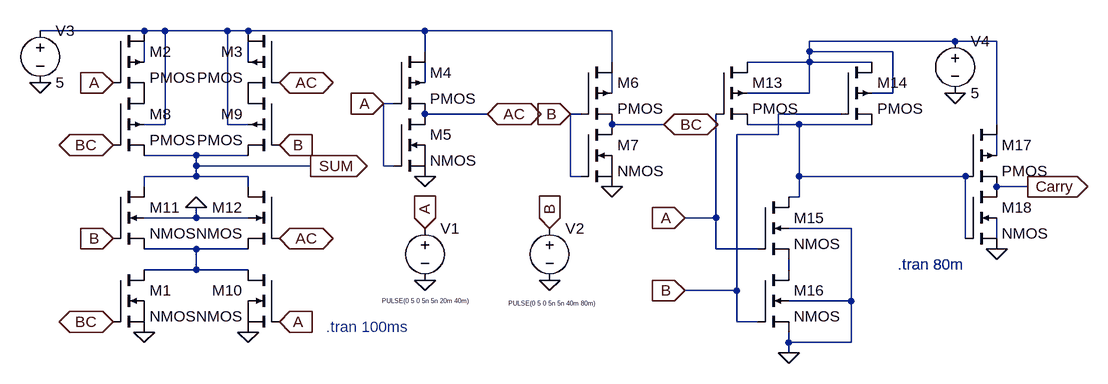
[diagram p0: schematic Half Adder sum and carry.asc]
Half Adder sum and carry.asc, the LTspice schematic file:
Version 4.1
SHEET 1 1616 680
WIRE -544 -256 -704 -256
WIRE -512 -256 -544 -256
WIRE -416 -256 -512 -256
WIRE -384 -256 -416 -256
WIRE -112 -256 -384 -256
WIRE 176 -256 -112 -256
WIRE 704 -240 480 -240
WIRE 768 -240 704 -240
WIRE -112 -224 -112 -256
WIRE 480 -224 480 -240
WIRE 608 -224 480 -224
WIRE -544 -208 -544 -240
WIRE -384 -208 -384 -240
WIRE 176 -208 176 -256
WIRE 480 -208 480 -224
WIRE 480 -208 384 -208
WIRE 576 -208 480 -208
WIRE -112 -176 -112 -208
WIRE 176 -160 176 -192
WIRE 480 -160 480 -208
WIRE 480 -160 384 -160
WIRE 608 -160 608 -224
WIRE 608 -160 576 -160
WIRE -160 -144 -176 -144
WIRE -16 -128 -112 -128
WIRE 128 -128 112 -128
WIRE 528 -128 432 -128
WIRE -512 -112 -512 -256
WIRE -512 -112 -544 -112
WIRE -416 -112 -416 -256
WIRE -384 -112 -416 -112
WIRE 256 -112 176 -112
WIRE 464 -112 384 -112
WIRE 576 -112 464 -112
WIRE 768 -112 768 -240
WIRE 432 -96 432 -128
WIRE 432 -96 368 -96
WIRE -464 -64 -544 -64
WIRE -384 -64 -464 -64
WIRE 768 -64 768 -96
WIRE -464 -48 -464 -64
WIRE -288 -48 -464 -48
WIRE -176 -48 -176 -144
WIRE -160 -48 -176 -48
WIRE -464 -32 -464 -48
WIRE -464 -32 -544 -32
WIRE -384 -32 -464 -32
WIRE 112 -32 112 -128
WIRE 128 -32 112 -32
WIRE 464 -32 464 -112
WIRE 720 -32 464 -32
WIRE -544 -16 -544 -32
WIRE -384 -16 -384 -32
WIRE 816 -16 768 -16
WIRE 464 0 464 -32
WIRE 464 0 448 0
WIRE -464 32 -464 16
WIRE -464 32 -544 32
WIRE -384 32 -464 32
WIRE 336 32 336 -128
WIRE 336 32 288 32
WIRE 544 48 448 48
WIRE 720 64 720 -32
WIRE 768 64 768 32
WIRE -464 80 -544 80
WIRE -384 80 -464 80
WIRE 336 80 336 32
WIRE 400 80 336 80
WIRE -464 112 -464 80
WIRE -464 112 -544 112
WIRE -384 112 -464 112
WIRE 448 112 448 96
WIRE 368 144 368 -96
WIRE 368 144 288 144
WIRE 544 160 544 48
WIRE 544 160 448 160
WIRE 368 192 368 144
WIRE 400 192 368 192
WIRE 448 224 448 208
WIRE 544 224 544 160
WIRE 544 224 448 224
WIRE 448 240 448 224
FLAG 80 128 0
FLAG -112 128 0
FLAG -704 -176 0
FLAG -288 -48 SUM
IOPIN -288 -48 Out
FLAG -544 208 0
FLAG -112 -32 0
FLAG 176 -16 0
FLAG -384 208 0
FLAG -112 48 A
IOPIN -112 48 In
FLAG 80 48 B
IOPIN 80 48 In
FLAG 112 -128 B
IOPIN 112 -128 In
FLAG -176 -144 A
IOPIN -176 -144 In
FLAG -16 -128 AC
IOPIN -16 -128 BiDir
FLAG 256 -112 BC
IOPIN 256 -112 BiDir
FLAG -592 -80 BC
IOPIN -592 -80 BiDir
FLAG -592 192 BC
IOPIN -592 192 BiDir
FLAG -592 -176 A
IOPIN -592 -176 In
FLAG -336 192 A
IOPIN -336 192 In
FLAG -336 -176 AC
IOPIN -336 -176 BiDir
FLAG -336 64 AC
IOPIN -336 64 BiDir
FLAG -592 64 B
IOPIN -592 64 In
FLAG -336 -80 B
IOPIN -336 -80 In
FLAG -464 16 0
FLAG 448 240 0
FLAG 288 144 B
IOPIN 288 144 In
FLAG 288 32 A
IOPIN 288 32 In
FLAG 704 -160 0
FLAG 768 80 0
FLAG 816 -16 Carry
IOPIN 816 -16 Out
SYMBOL nmos -592 112 R0
SYMATTR InstName M1
SYMBOL voltage -112 32 R0
WINDOW 3 -66 128 Left 0
WINDOW 123 0 0 Left 0
WINDOW 39 0 0 Left 0
SYMATTR Value PULSE(0 5 0 5n 5n 20m 40m)
SYMATTR InstName V1
SYMBOL voltage 80 32 R0
WINDOW 3 -63 132 Left 0
WINDOW 123 0 0 Left 0
WINDOW 39 0 0 Left 0
SYMATTR Value PULSE(0 5 0 5n 5n 40m 80m)
SYMATTR InstName V2
SYMBOL voltage -704 -272 R0
WINDOW 123 0 0 Left 0
WINDOW 39 0 0 Left 0
SYMATTR InstName V3
SYMATTR Value 5
SYMBOL pmos4 -592 -256 R0
SYMATTR InstName M2
SYMBOL pmos4 -336 -256 M0
SYMATTR InstName M3
SYMBOL pmos4 -160 -224 R0
SYMATTR InstName M4
SYMBOL nmos -160 -128 R0
SYMATTR InstName M5
SYMBOL pmos4 128 -208 R0
SYMATTR InstName M6
SYMBOL nmos 128 -112 R0
SYMATTR InstName M7
SYMBOL pmos4 -592 -160 R0
SYMATTR InstName M8
SYMBOL pmos4 -336 -160 M0
SYMATTR InstName M9
SYMBOL nmos -336 112 M0
SYMATTR InstName M10
SYMBOL nmos4 -592 -16 R0
SYMATTR InstName M11
SYMBOL nmos4 -336 -16 M0
SYMATTR InstName M12
SYMBOL pmos4 336 -208 R0
SYMATTR InstName M13
SYMBOL pmos4 528 -208 R0
SYMATTR InstName M14
SYMBOL nmos4 400 0 R0
SYMATTR InstName M15
SYMBOL nmos4 400 112 R0
SYMATTR InstName M16
SYMBOL voltage 704 -256 R0
WINDOW 123 0 0 Left 0
WINDOW 39 0 0 Left 0
SYMATTR InstName V4
SYMATTR Value 5
SYMBOL pmos4 720 -112 R0
SYMATTR InstName M17
SYMBOL nmos4 720 -16 R0
SYMATTR InstName M18
TEXT -264 200 Left 2 ;.tran 100ms
TEXT 616 104 Left 2 !.tran 80m
TEXT 616 104 Left 2 ;.tran 80m
TEXT 616 104 Left 2 ;.tran 80m
TEXT 616 104 Left 2 ;.tran 80m

The netlist it stands for:
* Half Adder sum and carry.asc
M1 N010 BC 0 0 NMOS
V1 A 0 PULSE(0 5 0 5n 5n 20m 40m)
V2 B 0 PULSE(0 5 0 5n 5n 40m 80m)
V3 N001 0 5
M2 N001 A P001 N003 PMOS
M3 N001 AC P002 N004 PMOS
M4 N001 A AC N005 PMOS
M5 AC A 0 0 NMOS
M6 N001 B BC N006 PMOS
M7 BC B 0 0 NMOS
M8 P001 BC SUM N001 PMOS
M9 P002 B SUM N001 PMOS
M10 N010 A 0 0 NMOS
M11 SUM B N010 0 NMOS
M12 SUM AC N010 0 NMOS
M13 N002 A N007 N002 PMOS
M14 N002 B N007 N002 PMOS
M15 N007 A N011 0 NMOS
M16 N011 B 0 0 NMOS
V4 N002 0 5
M17 N002 N007 Carry N008 PMOS
M18 Carry N007 0 N009 NMOS
.model NMOS NMOS
.model PMOS PMOS
.lib standard.mos
* .tran 100ms
.tran 80m
* .tran 80m
* .tran 80m
* .tran 80m
.backanno
.end